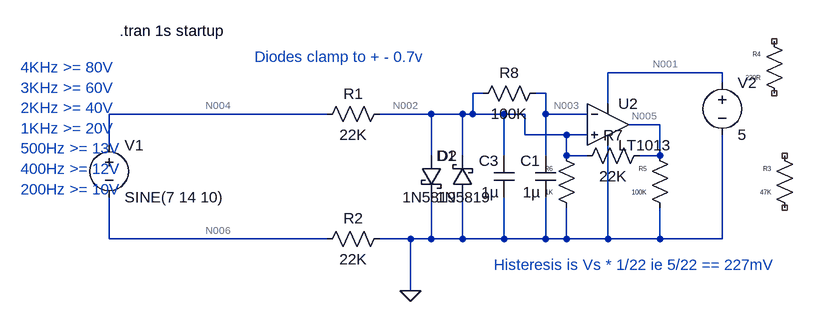
[diagram p0: schematic FlyWheelPickup.asc]
FlyWheelPickup.asc, the LTspice schematic file:
Version 4
SHEET 1 1048 680
WIRE 816 192 640 192
WIRE 816 208 816 192
WIRE 448 224 432 224
WIRE 544 224 528 224
WIRE 640 240 640 192
WIRE 208 256 -128 256
WIRE 368 256 288 256
WIRE 416 256 368 256
WIRE 432 256 432 224
WIRE 432 256 416 256
WIRE 480 256 432 256
WIRE 512 256 480 256
WIRE 544 256 544 224
WIRE 608 256 544 256
WIRE 720 272 672 272
WIRE 512 288 512 256
WIRE 576 288 512 288
WIRE 608 288 576 288
WIRE -128 304 -128 256
WIRE 368 320 368 256
WIRE 416 320 416 256
WIRE 480 320 480 256
WIRE 544 320 544 256
WIRE 576 320 576 288
WIRE 608 320 576 320
WIRE 720 320 720 272
WIRE 720 320 688 320
WIRE -128 448 -128 384
WIRE 208 448 -128 448
WIRE 336 448 288 448
WIRE 368 448 368 384
WIRE 368 448 336 448
WIRE 416 448 416 384
WIRE 416 448 368 448
WIRE 480 448 480 384
WIRE 480 448 416 448
WIRE 544 448 544 384
WIRE 544 448 480 448
WIRE 576 448 576 400
WIRE 576 448 544 448
WIRE 640 448 640 304
WIRE 640 448 576 448
WIRE 720 448 720 400
WIRE 720 448 640 448
WIRE 816 448 816 288
WIRE 816 448 720 448
WIRE 336 528 336 448
FLAG 336 528 0
SYMBOL voltage -128 288 R0
SYMATTR InstName V1
SYMATTR Value SINE(7 14 10)
SYMBOL res 304 240 R90
WINDOW 0 0 56 VBottom 2
WINDOW 3 32 56 VTop 2
SYMATTR InstName R1
SYMATTR Value 22K
SYMBOL res 304 432 R90
WINDOW 0 0 56 VBottom 2
WINDOW 3 32 56 VTop 2
SYMATTR InstName R2
SYMATTR Value 22K
SYMBOL voltage 816 192 R0
SYMATTR InstName V2
SYMATTR Value 5
SYMATTR SpiceLine Rser=10
SYMBOL res 928 416 R180
WINDOW 0 36 76 Left 0
WINDOW 3 36 40 Left 0
SYMATTR InstName R3
SYMATTR Value 47K
SYMBOL cap 496 384 R180
WINDOW 0 24 56 Left 2
WINDOW 3 24 8 Left 2
SYMATTR InstName C3
SYMATTR Value 1µ
SYMBOL res 736 416 R180
WINDOW 0 36 76 Left 0
WINDOW 3 36 40 Left 0
SYMATTR InstName R5
SYMATTR Value 100K
SYMBOL res 592 416 R180
WINDOW 0 36 76 Left 0
WINDOW 3 36 40 Left 0
SYMATTR InstName R6
SYMATTR Value 1K
SYMBOL res 592 336 R270
WINDOW 0 32 56 VTop 2
WINDOW 3 0 56 VBottom 2
SYMATTR InstName R7
SYMATTR Value 22K
SYMBOL schottky 352 320 R0
SYMATTR InstName D1
SYMATTR Value 1N5819
SYMATTR Description Diode
SYMATTR Type diode
SYMBOL schottky 432 384 R180
WINDOW 0 24 64 Left 2
WINDOW 3 24 0 Left 2
SYMATTR InstName D2
SYMATTR Value 1N5819
SYMATTR Description Diode
SYMATTR Type diode
SYMBOL Opamps/LT1013 640 208 R0
SYMATTR InstName U2
SYMBOL res 912 240 R180
WINDOW 0 36 76 Left 0
WINDOW 3 36 40 Left 0
SYMATTR InstName R4
SYMATTR Value 220R
SYMBOL res 432 240 R270
WINDOW 0 32 56 VTop 2
WINDOW 3 0 56 VBottom 2
SYMATTR InstName R8
SYMATTR Value 100K
SYMBOL cap 560 384 R180
WINDOW 0 24 56 Left 2
WINDOW 3 24 8 Left 2
SYMATTR InstName C1
SYMATTR Value 1µ
TEXT -112 128 Left 2 !.tran 1s startup
TEXT -264 184 Left 2 ;4KHz >= 80V\n3KHz >= 60V\n2KHz >= 40V\n1KHz >= 20V\n500Hz >= 13V\n400Hz >= 12V\n200Hz >= 10V
TEXT 96 168 Left 2 ;Diodes clamp to + - 0.7v
TEXT 464 488 Left 2 ;Histeresis is Vs * 1/22 ie 5/22 == 227mV

The netlist it stands for:
* FlyWheelPickup.asc
V1 N004 N006 SINE(7 14 10)
R1 N002 N004 22K
R2 0 N006 22K
V2 N001 0 5 Rser=10
R3 NC_01 NC_02 47K
C3 0 N002 1µ
R5 0 N005 100K
R6 0 N002 1K
R7 N002 N005 22K
D1 N002 0 1N5819
D2 0 N002 1N5819
XU2 N002 N003 N001 0 N005 LT1013  ; pins In+ In- V+ V- OUT
R4 NC_03 NC_04 220R
R8 N002 N003 100K
C1 0 N003 1µ
.model D D
.lib standard.dio
.tran 1s startup
* 4KHz >= 80V
* 3KHz >= 60V
* 2KHz >= 40V
* 1KHz >= 20V
* 500Hz >= 13V
* 400Hz >= 12V
* 200Hz >= 10V
* Diodes clamp to + - 0.7v
* Histeresis is Vs * 1/22 ie 5/22 == 227mV
.lib LTC.lib
.backanno
.end

* Results of the author's LTspice run, read from the files saved beside the schematic
* Operating Point, zero values left out:
*   V(n004) = 3.519 V
*   V(n006) = -3.481 V
*   V(n002) = 37.97 mV
*   V(n001) = 1.246 mV
*   V(n005) = 61.44 µV
*   V(n003) = 1.609 mV
*   I(D2) = -20.82 µA
*   I(D1) = 60.63 µA
*   I(R8) = 363.6 nA
*   I(R7) = 1.723 µA
*   I(R6) = -37.97 µA
*   I(R5) = -614.4 pA
*   I(R2) = 158.2 µA
*   I(R1) = -158.2 µA
*   I(V2) = 124.6 µA
*   I(V1) = -158.2 µA
*   Ix(u2:1) = 36.72 µA
*   Ix(u2:2) = 363.6 nA
*   Ix(u2:3) = -124.6 µA
*   Ix(u2:4) = 84.17 µA
*   Ix(u2:5) = 1.722 µA
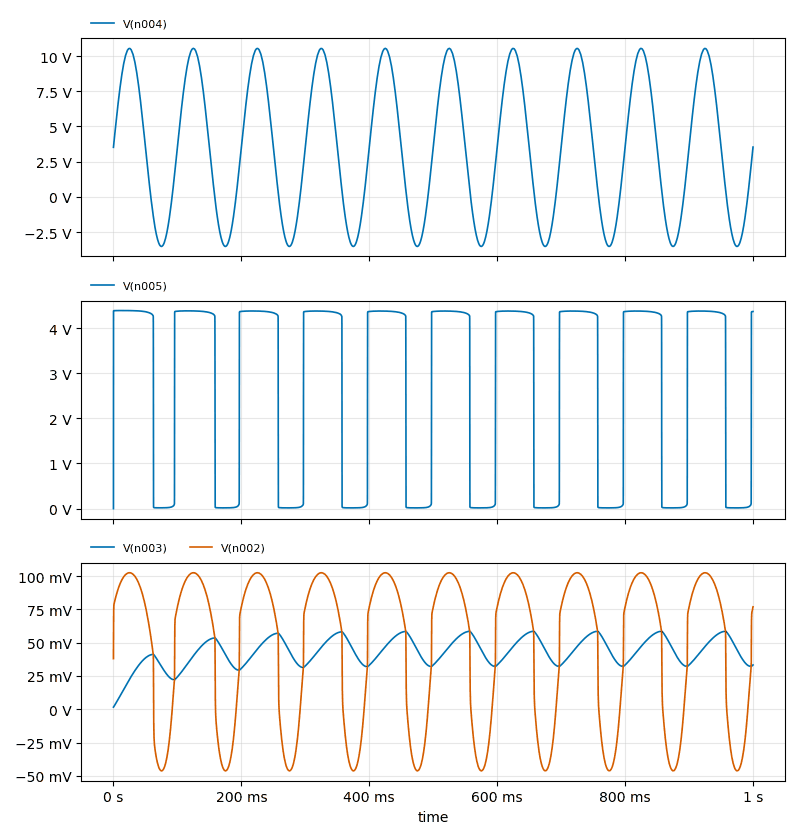
[diagram p1: Transient Analysis of FlyWheelPickup.asc, plotted from the saved traces]
* Transient Analysis, 1 run:
*   V(n004): min -3.517 V, max 10.54 V, average 3.518 V, rms 6.093 V, last 3.538 V
*   V(n005): min 61.44 µV, max 4.389 V, average 2.668 V, rms 3.404 V, last 4.367 V
*   V(n003): min 1.609 mV, max 58.57 mV, average 43.19 mV, rms 44.48 mV, last 33.27 mV
*   V(n002): min -46.19 mV, max 102.5 mV, average 45.11 mV, rms 73.48 mV, last 76.92 mV